# EAGLE design 1010-B1-solarwhat-light (EAGLE 7.5.0)

## Sheet 1 of 3
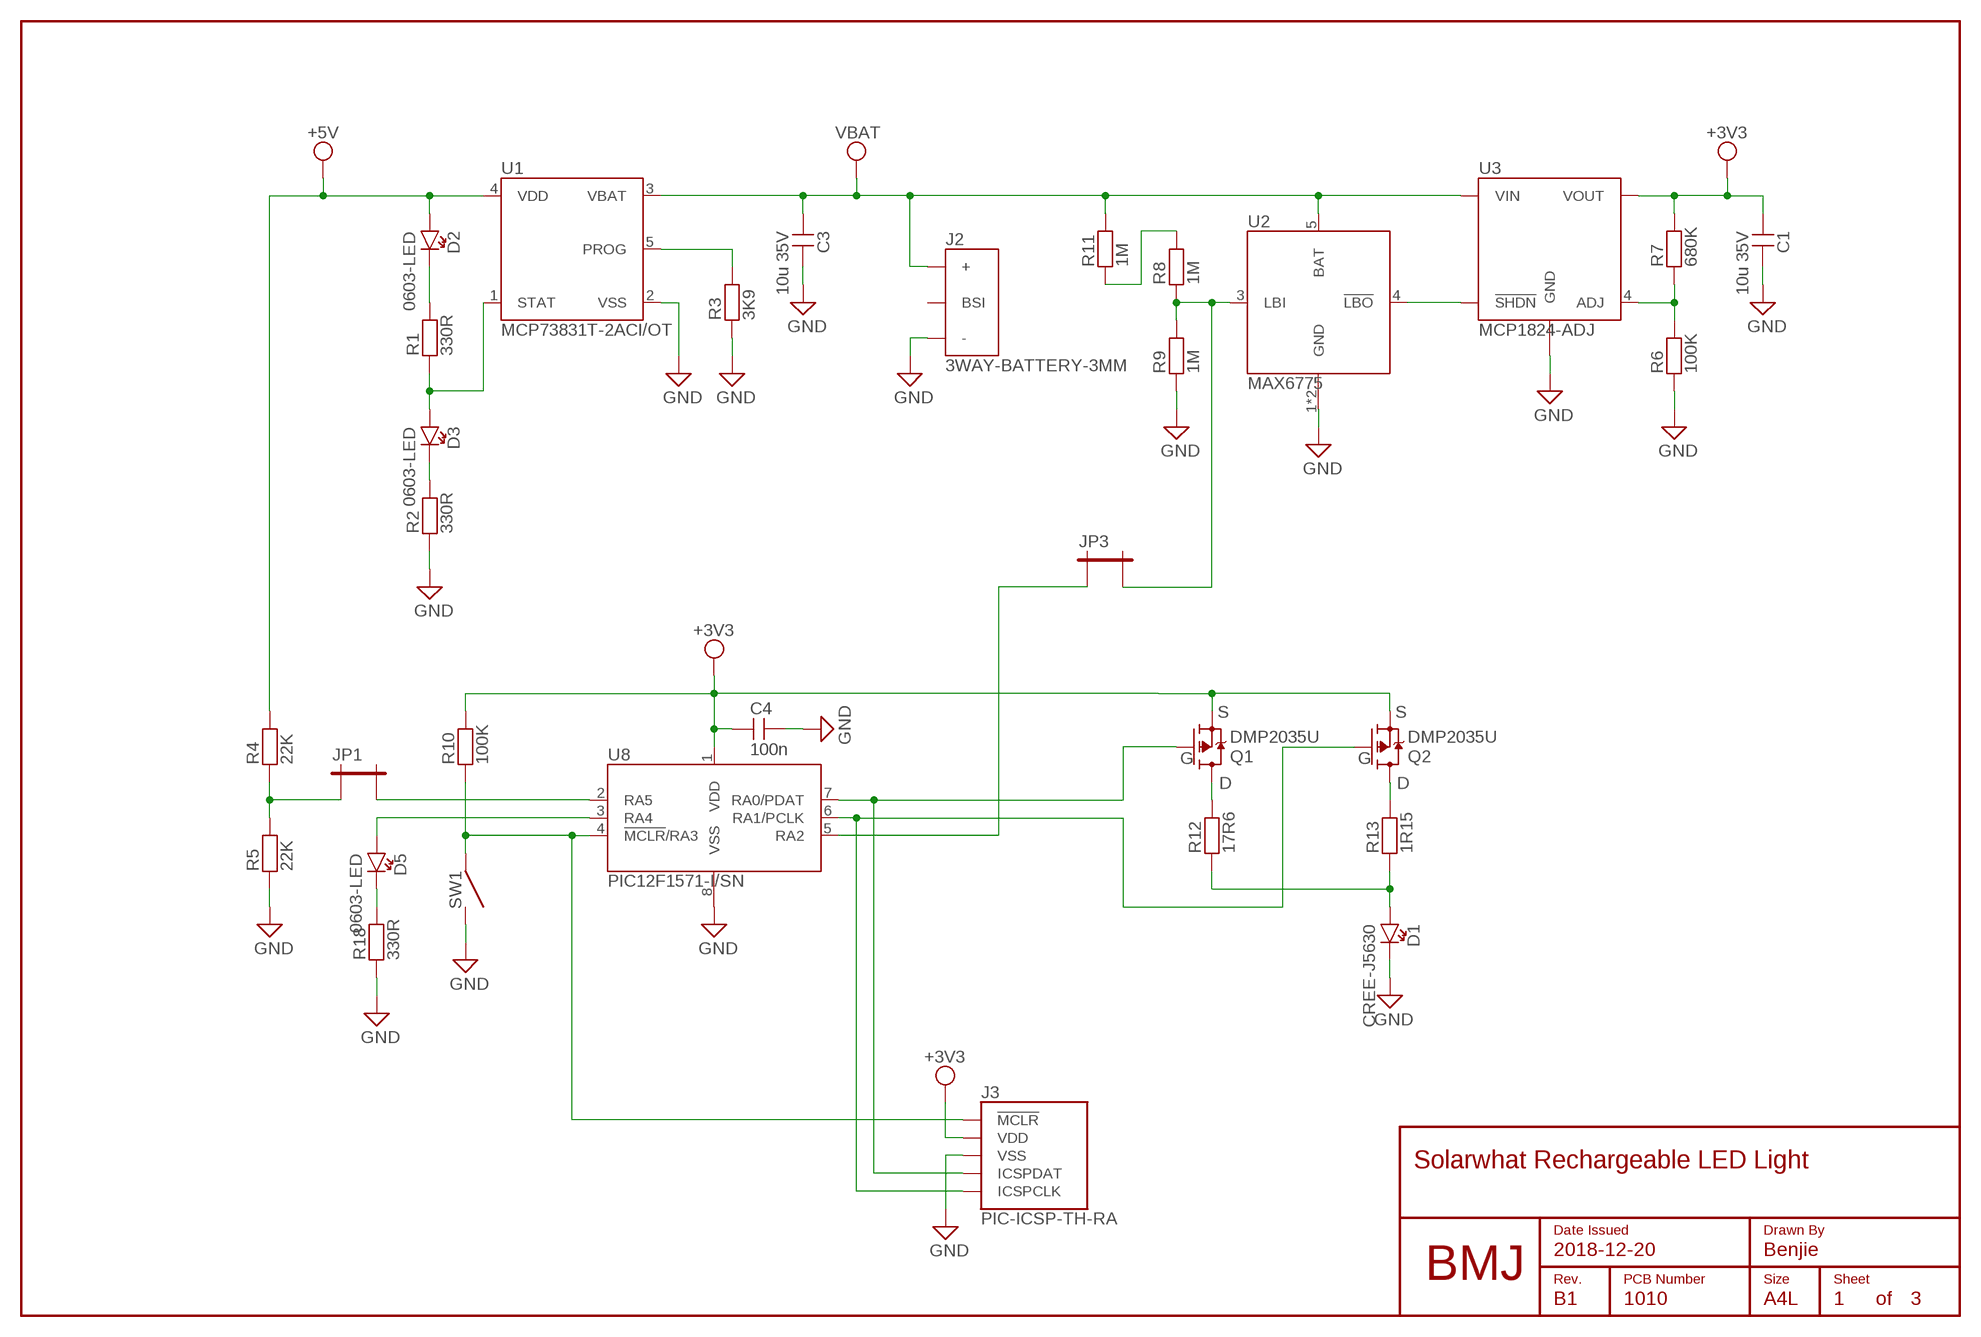
[diagram p0: schematic, sheet 1]

### Parts
C1  10u 35V  1206-10U-35V  [1206]
C3  10u 35V  1206-10U-35V  [1206]
C4  100n  0603-100N  [0603]
D1  CREE-J5630  [CREE-J5630]
D2  0603-LED  [0603-LED]
D3  0603-LED  [0603-LED]
D5  0603-LED  [0603-LED]
FRAME1  A4L-NEW  [PCB-ID]
J2  3WAY-BATTERY-3MM  [3MM-BATTERY-3WAY]
J3  PIC-ICSP-TH-RA  [PIC-ICSP-TH-RA]
JP1  SOLDER-JUMPER-1MM-SQUARE  [SOLDER-JUMPER-1-1]
JP3  SOLDER-JUMPER-1MM-SQUARE  [SOLDER-JUMPER-1-1]
LOGO1  BMJ-LOGO  [BMJ-LOGO]
Q1  DMP2035U  [SOT-23]
Q2  DMP2035U  [SOT-23]
R1  330R  0603-1%-330R  [0603]
R2  330R  0603-1%-330R  [0603]
R3  3K9  0603-1%-3K9  [0603]
R4  22K  0603-1%-22K  [0603]
R5  22K  0603-1%-22K  [0603]
R6  100K  0603-1%-100K  [0603]
R7  680K  0603-1%-680K  [0603]
R8  1M  0603-1%-1M  [0603]
R9  1M  0603-1%-1M  [0603]
R10  100K  0603-1%-100K  [0603]
R11  1M  0603-1%-1M  [0603]
R12  17R6  0805-1%-17R6  [0805]
R13  1R15  0805-1%-1R15  [0805]
R18  330R  0603-1%-330R  [0603]
SW1  ALCOSWITCH-FSM4JSMA  [ALCOSWITCH-FSM4JSMA]
U1  MCP73831T-2ACI/OT  [SOT-23-5]
U2  MAX6775  [SC70]
U3  MCP1824-ADJ  [SOT-23-5]
U8  PIC12F1571-I/SN  [SOIC-8]

### Nets
+3V3: C1.1 C4.1 J3.2(VDD) Q1.2(S) Q2.2(S) R7.2 R10.2 U3.5(VOUT) U8.1(VDD)
+5V: D2.A R4.2 U1.4(VDD) ; also sheet 2
GND: C1.2 C3.2 C4.2 D1.K(C) J2.- J3.3(VSS) R2.1 R3.1 R5.1 R6.1 R9.1 R18.1 SW1.2@1(NO) SW1.2@2(NO) U1.2(VSS) U2.1(GND) U2.2(GND) U3.2(GND) U8.8(VSS) ; also sheet 2
LED_ANODE: D1.A R12.1 R13.1
N$1: D3.C R2.2
N$2: R3.2 U1.5(PROG)
N$3: D3.A R1.1 U1.1(STAT)
N$4: D2.C R1.2
N$5: JP1.1 R4.1 R5.2
N$6: JP1.2 U8.2(RA5)
N$8: R6.2 R7.1 U3.4(ADJ)
N$9: Q2.3(D) R13.2
N$10: JP3.2 R8.1 R9.2 U2.3(LBI)
N$11: J3.5(ICSPCLK) Q2.1(G) U8.6(RA1/PCLK)
N$12: R8.2 R11.1
N$13: Q1.3(D) R12.2
N$14: D5.A U8.3(RA4)
N$17: U2.4(!LBO) U3.3(!SHDN)
N$19: D5.C R18.2
N$24: J3.4(ICSPDAT) Q1.1(G) U8.7(RA0/PDAT)
N$25: J3.1(!MCLR) R10.1 SW1.1@1(COM) SW1.1@2(COM) U8.4(!MCLR!/RA3)
N$26: JP3.1 U8.5(RA2)
VBAT: C3.1 J2.+ R11.2 U1.3(VBAT) U2.5(BAT) U3.1(VIN)
Unconnected: J2.BSI

## Sheet 2 of 3
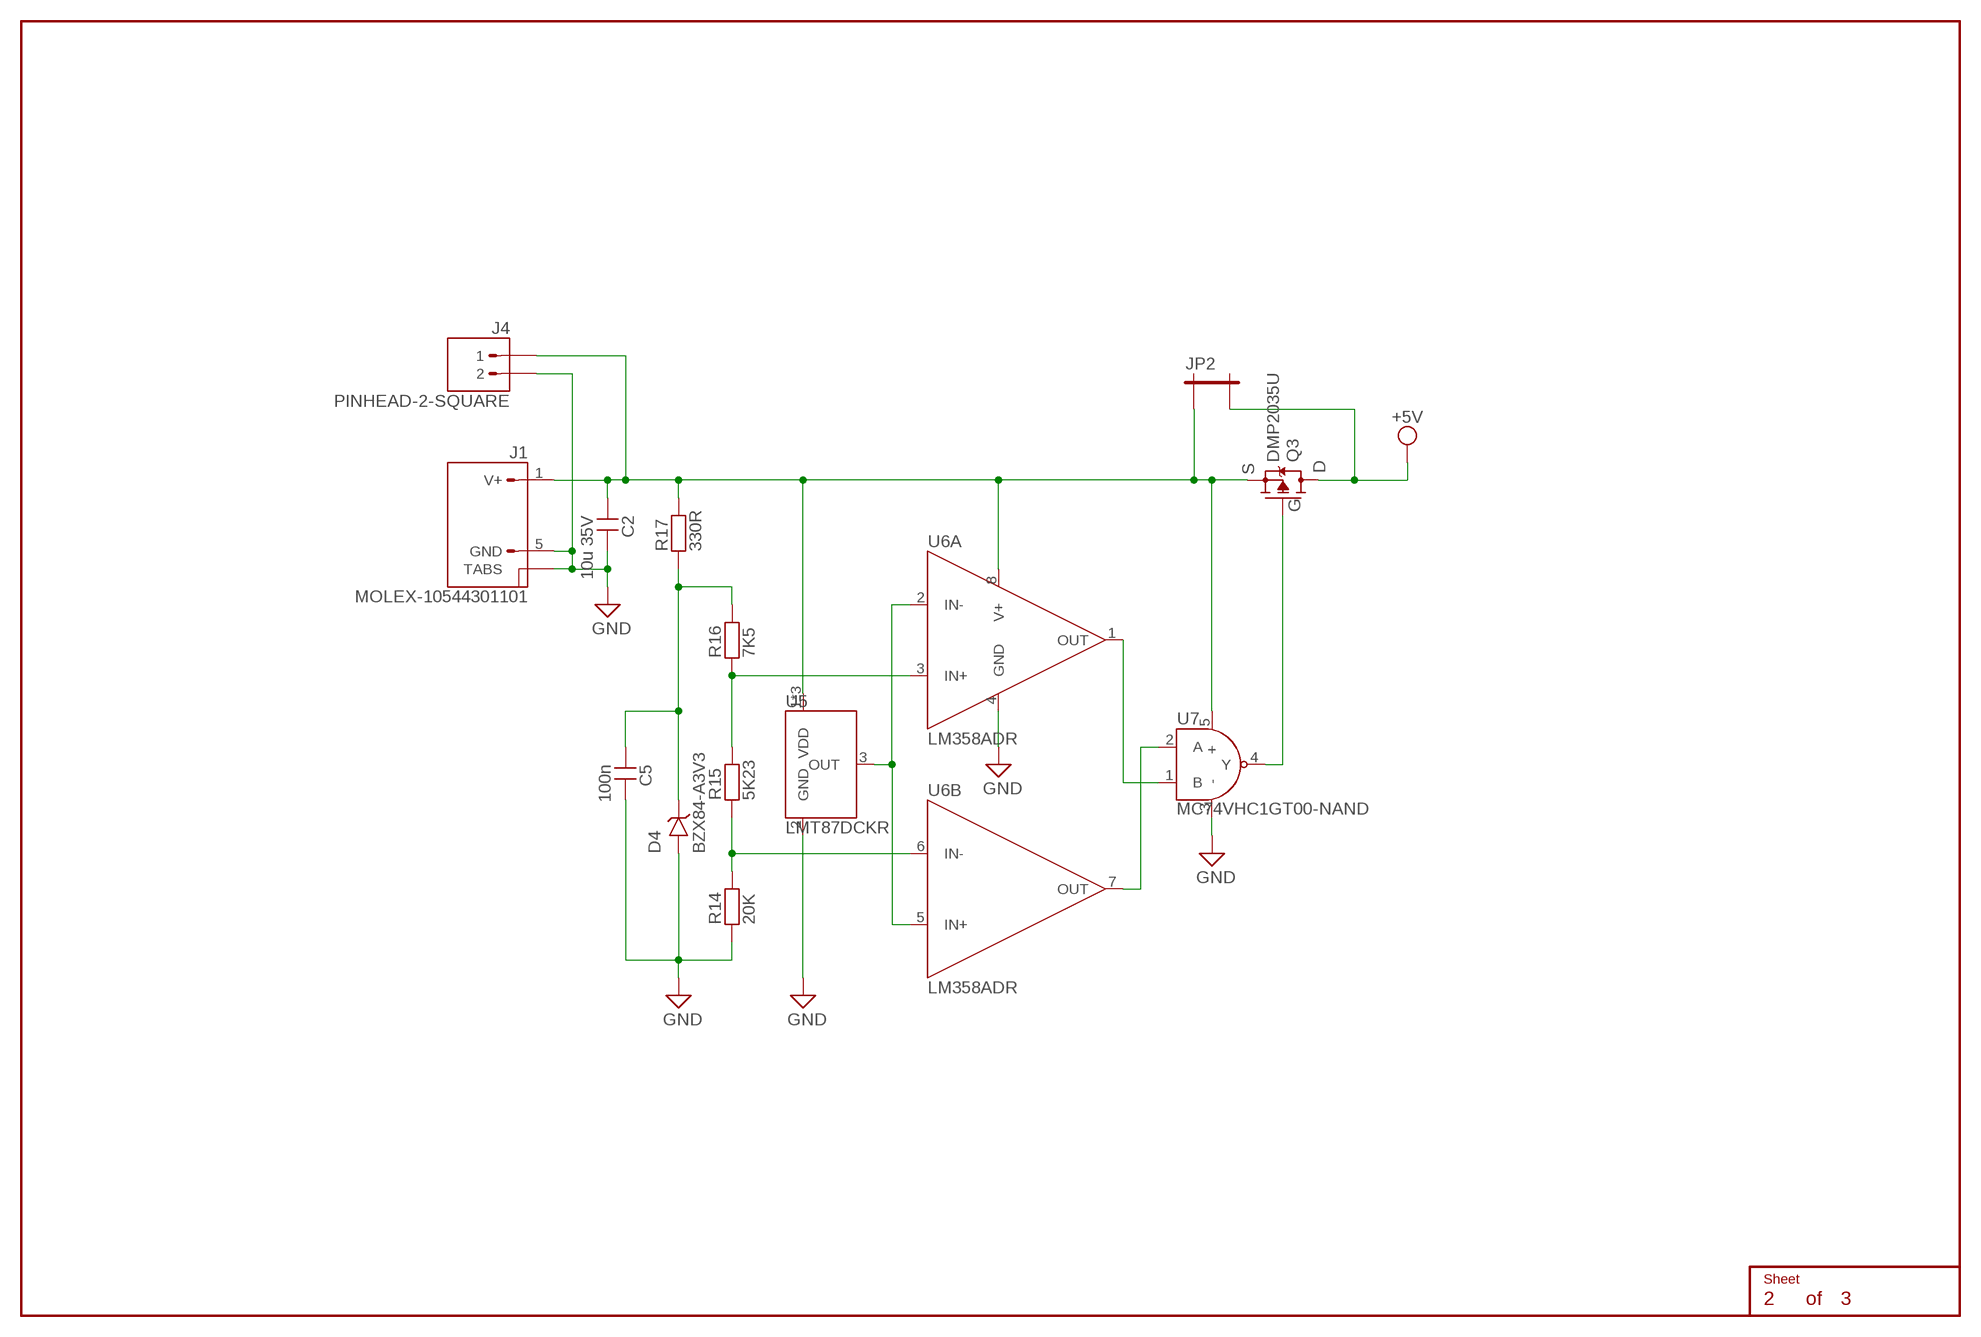
[diagram p1: schematic, sheet 2]

### Parts
C2  10u 35V  1206-10U-35V  [1206]
C5  100n  0603-100N  [0603]
D4  BZX84-A3V3  [SOT-23]
FRAME2  A4L-CONTINUATION  [EMPTY]
J1  MOLEX-10544301101  MOLEX-10544301101-POWERONLY  [MOLEX-105443-1101-POWERONLY]
J4  PINHEAD-2-SQUARE  [PINHEAD-2-SQUARE]
JP2  SOLDER-JUMPER-1MM-SQUARE  [SOLDER-JUMPER-1-1]
Q3  DMP2035U  [SOT-23]
R14  20K  0603-1%-20K  [0603]
R15  5K23  0603-1%-5K23  [0603]
R16  7K5  0603-1%-7K5  [0603]
R17  330R  0603-1%-330R  [0603]
U5  LMT87DCKR  [SC70]
U6  LM358ADR  [SOIC-8]
U7  MC74VHC1GT00-NAND  [SC70]

### Nets
+5V: JP2.2 Q3.3(D) ; also sheet 1
GND: C2.2 C5.2 D4.1(A) J1.5(GND) J1.GND@1(TABS) J1.GND@2(TABS) J1.GND@3(TABS) J1.GND@4(TABS) J1.GND@5(TABS) J1.GND@6(TABS) J4.2 R14.1 U5.2(GND) U6.4(A:GND) U7.3(-) ; also sheet 1
N$7: C2.1 J1.1(V+) J4.1 JP2.1 Q3.2(S) R17.2 U5.1(VDD) U5.4(VDD) U5.5(VDD) U6.8(A:V+) U7.5(+)
N$15: U6.1(A:OUT) U7.1(B)
N$16: U6.7(B:OUT) U7.2(A)
N$18: Q3.1(G) U7.4(Y)
N$20: U5.3(OUT) U6.2(A:IN-) U6.5(B:IN+)
N$21: R14.2 R15.1 U6.6(B:IN-)
N$22: R15.2 R16.1 U6.3(A:IN+)
N$23: C5.1 D4.3(K) R16.2 R17.1

## Sheet 3 of 3
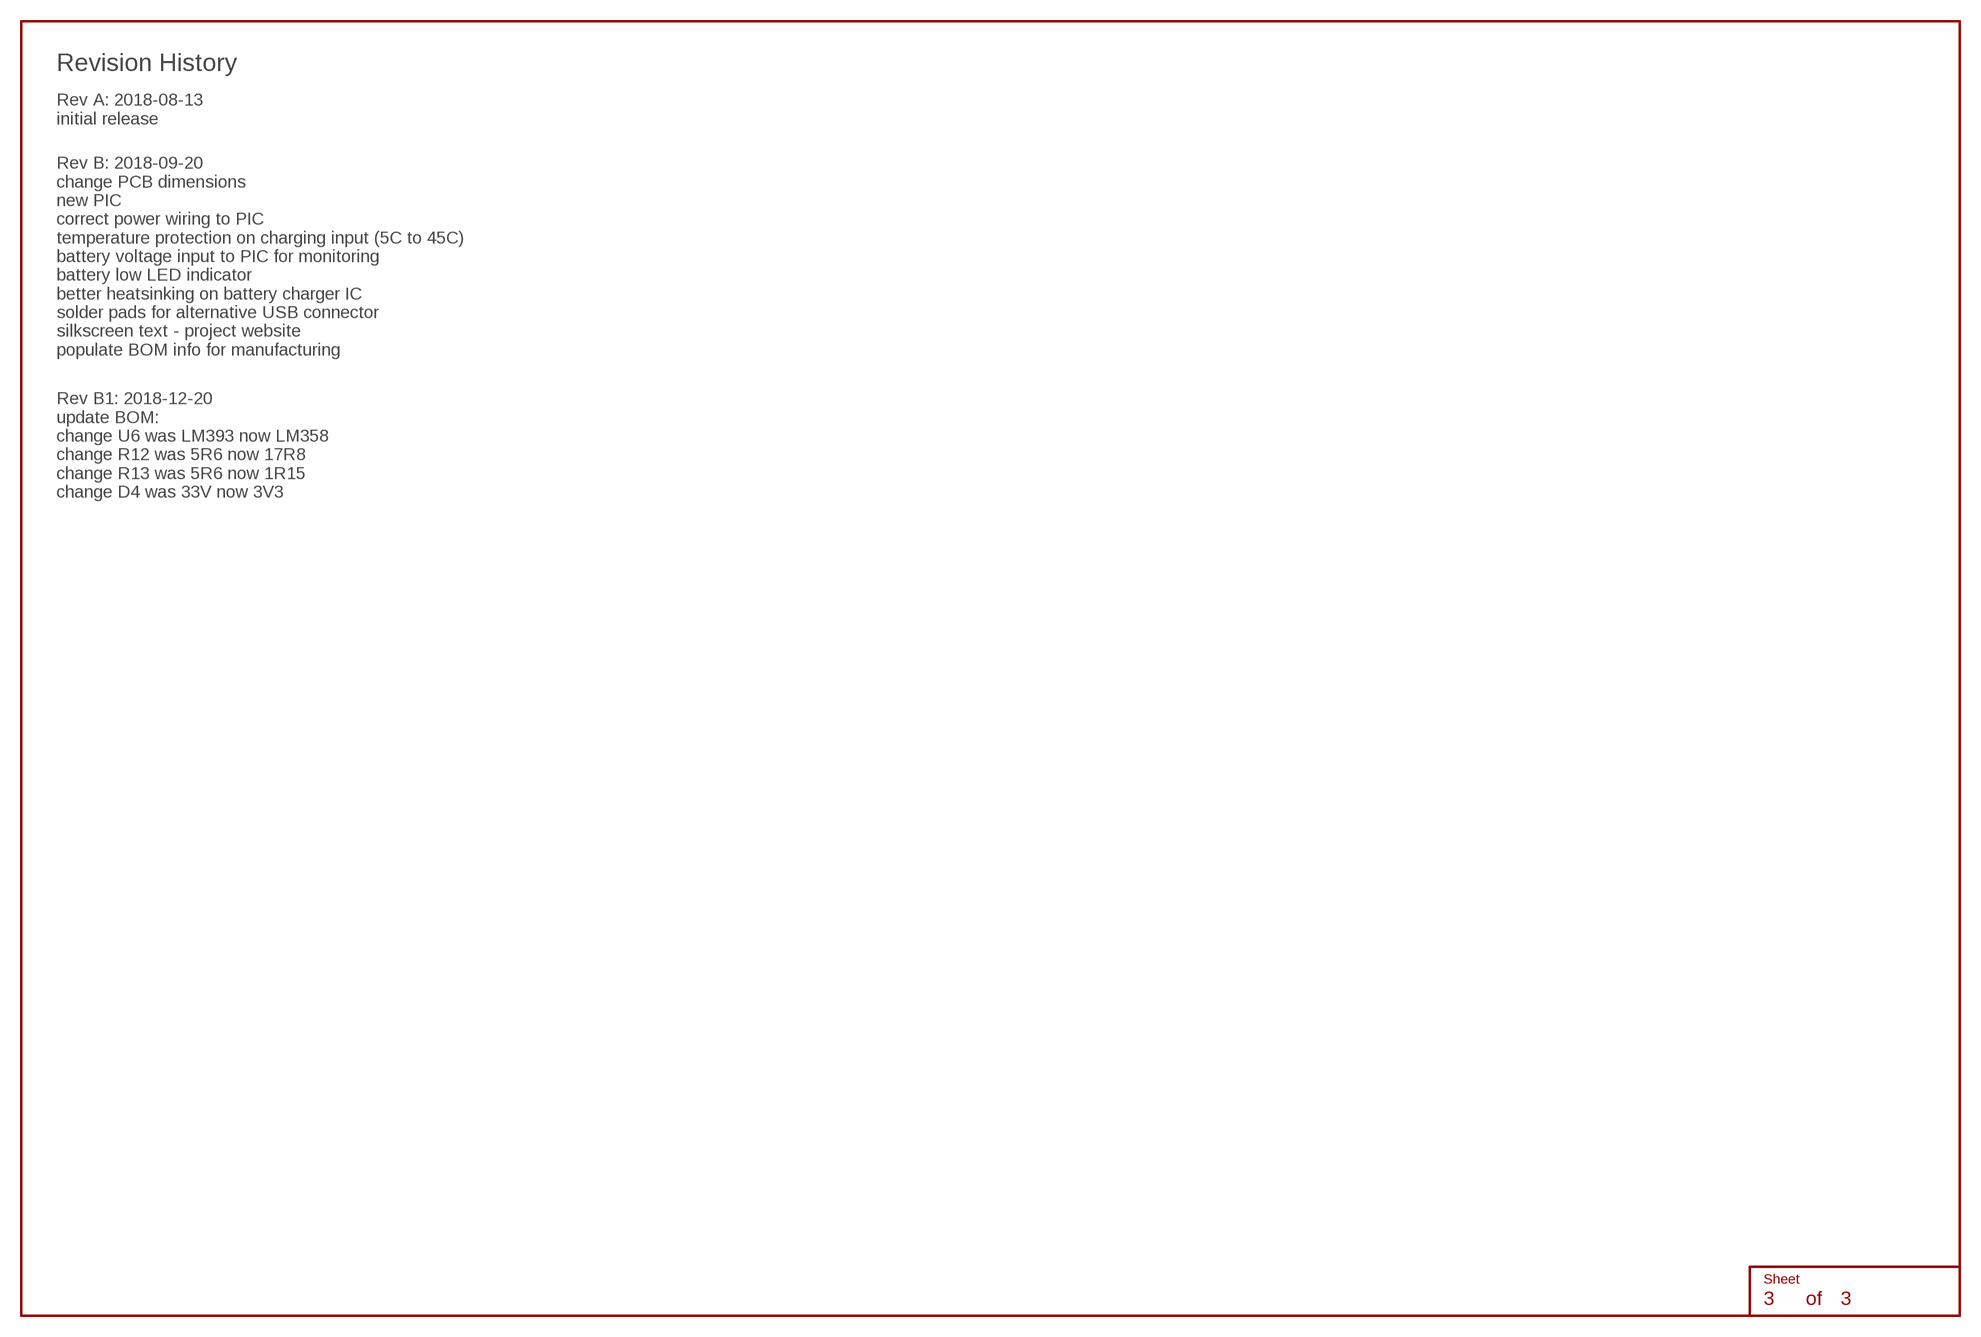
[diagram p2: schematic, sheet 3]

### Parts
FRAME3  A4L-CONTINUATION  [EMPTY]

### Notes on the sheet
- Revision History
- Rev A: 2018-08-13
  initial release
- Rev B: 2018-09-20
  change PCB dimensions
  new PIC
  correct power wiring to PIC
  temperature protection on charging input (5C to 45C)
  battery voltage input to PIC for monitoring
  battery low LED indicator
  better heatsinking on battery charger IC
  solder pads for alternative USB connector
  silkscreen text - project website
  populate BOM info for manufacturing
- Rev B1: 2018-12-20
  update BOM:
  change U6 was LM393 now LM358
  change R12 was 5R6 now 17R8
  change R13 was 5R6 now 1R15
  change D4 was 33V now 3V3

## Library data of the parts
C1-C3 = capacitor-standard:1206; MPN: 1206 10uF 35V 10% X7R; SPN: standard
C4 C5 = capacitor-standard:0603; MPN: 0603 100nF 50V 10% X7R; SPN: standard
D1 = led:CREE-J5630; MPN: Cree JB5630AWT-C0-0000-000A0UC430E; SPN: Farnell 2853292
D2 = led:0603-LED; MPN: 0603 orange; SPN: Farnell 2687484
D3 = led:0603-LED; MPN: 0603 green; SPN: Farnell 2687486
D4 = diode:BZX84; MPN: Nexperia BZX84-A3V3; SPN: Farnell 2463632
D5 = led:0603-LED; MPN: 0603 red; SPN: Farnell 2687488
FRAME1 = frame:A4L-NEW; DATEISSUED: 2018-12-20; DRAWNBY: Benjie; PCBNUMBER: 1010; REVISION: B1; TITLE: Solarwhat Rechargeable LED Light
FRAME2 FRAME3 = frame:A4L-CONTINUATION
J1 = connector-usb:MOLEX-10544301101-POWERONLY; MPN: Molex 10544301-1101; SPN: Farnell 2500017
J2 = connector:3WAY-BATTERY-3MM; MPN: AVX 009155003301006; SPN: Digi-key 478-4687-1-ND
J3 = connector:PIC-ICSP; NOTES: Do not populate
J4 = connector-pinheader:PINHEAD-2; NOTES: Do not populate
JP1 = pcb-features:SOLDER-JUMPER; BOM: no; NOTES: Bridge
JP2 JP3 = pcb-features:SOLDER-JUMPER; BOM: no; NOTES: Do not populate
LOGO1 = logo:BMJ-LOGO
Q1-Q3 = transistor:DMP2035U; MPN: Diodes Inc DMP2035U; SPN: Farnell 2061419
R1 R2 R17 R18 = resistor-standard:0603-1%; MPN: 0603 330R 1% 100mW; SPN: standard
R3 = resistor-special:0603-1%; MPN: 0603 3K9 1% 100mW; SPN: standard
R4 R5 = resistor-standard:0603-1%; MPN: 0603 22K 1% 100mW; SPN: standard
R6 R10 = resistor-standard:0603-1%; MPN: 0603 100K 1% 100mW; SPN: standard
R7 = resistor-standard:0603-1%; MPN: 0603 680K 1% 100mW; SPN: standard
R8 R9 R11 = resistor-standard:0603-1%; MPN: 0603 1M 1% 100mW; SPN: standard
R12 = resistor-special:0805-1%; MPN: 0805 17R8 1% 100mW; SPN: Farnell 2303354
R13 = resistor-special:0805-1%; MPN: 0805 1R15 1% 100mW; SPN: Farnell 2141631
R14 = resistor-special:0603-1%; MPN: 0603 20K 1% 100mW; SPN: standard
R15 = resistor-special:0603-1%; MPN: 0603 5K23 1% 100mW; SPN: standard
R16 = resistor-special:0603-1%; MPN: 0603 7K5 1% 100mW; SPN: standard
SW1 = switch:ALCOSWITCH-FSM4JSMA; MPN: Alcoswitch FSM4JSMA; SPN: Farnell 3801305
U1 = ic-power:MCP73831; MPN: Microchip MCP73831T-2ACI/OT; SPN: Farnell 1332158
U2 = ic-power:MAX6775; MPN: Maxim MAX6775XKB+T; SPN: Farnell 2799268
U3 = ic-power:MCP1824-ADJ; MPN: Microchip MCP1824T-ADJE/OT; SPN: Farnell 1578393
U5 = ic-sensor:LMT87; MPN: TI LMT87DCKR; SPN: Farnell 2782528
U6 = ic-analog:LM358; MPN: TI LM358ADR; SPN: Farnell 7527007
U7 = ic-digital:MC74VHC1GT00-NAND; MPN: On Semi MC74VHC1GT00DF; SPN: Farnell 2724115
U8 = ic-microcontroller:PIC12F1571; MPN: Microchip PIC12F1571-I/SN; SPN: Farnell 2419682

## Board
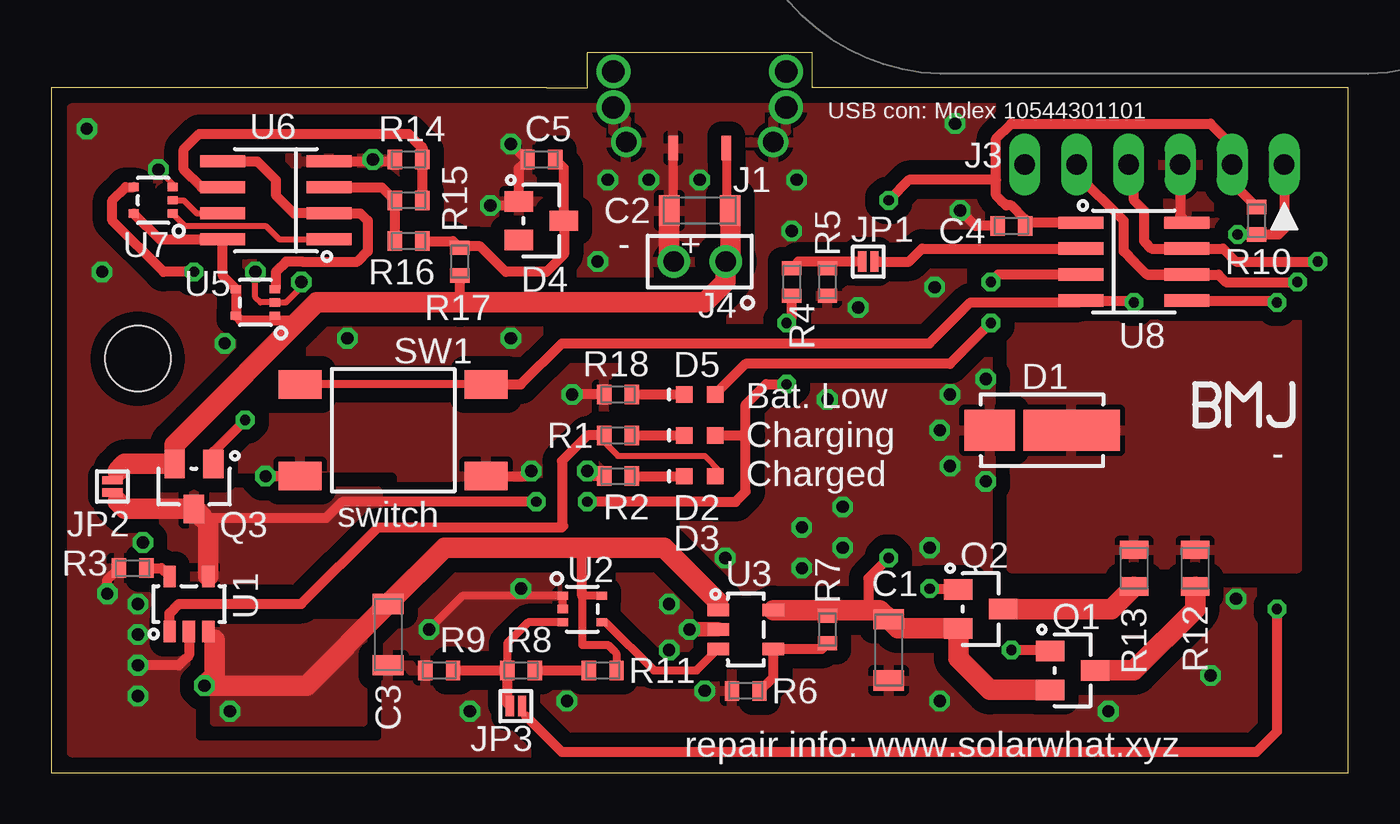
[diagram p3: board, top side]
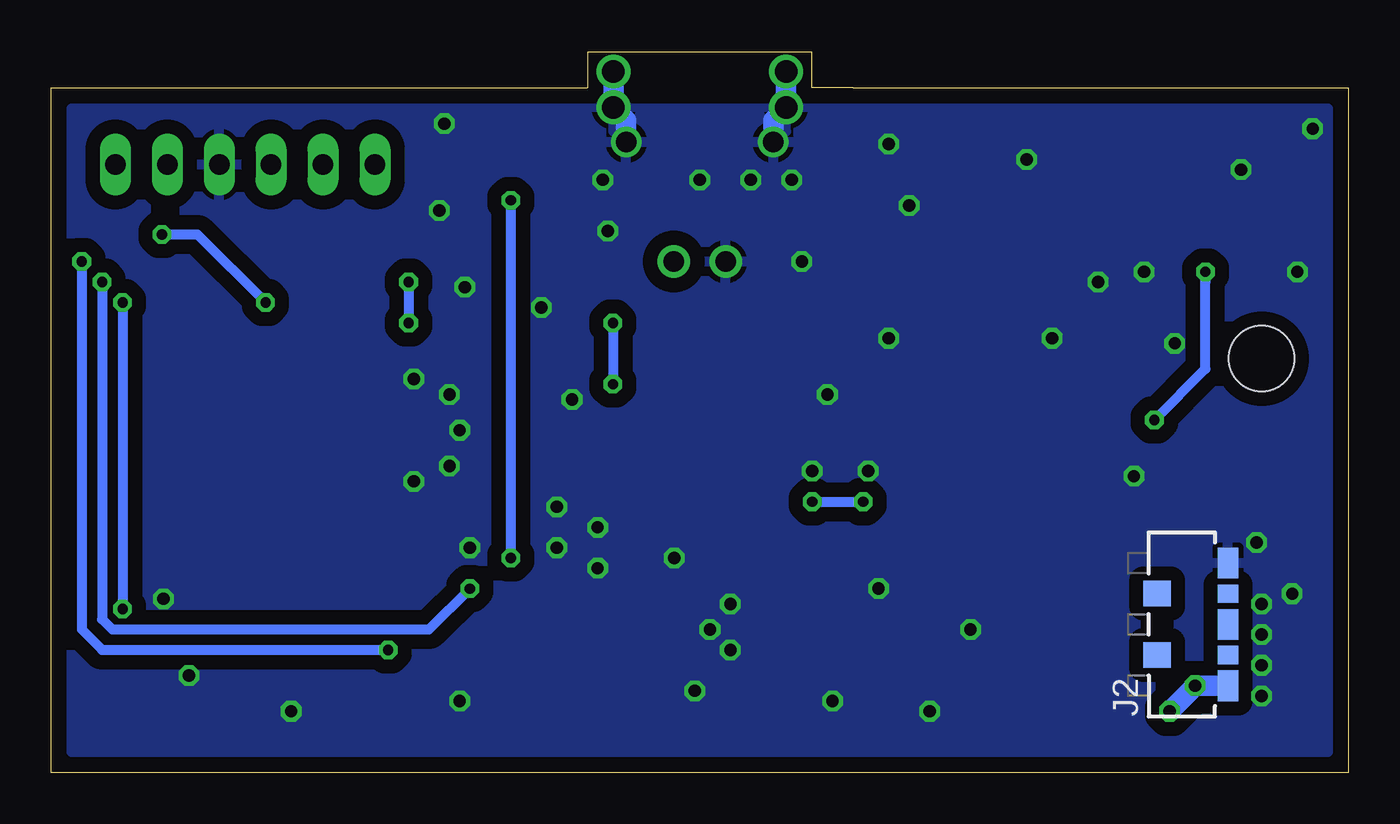
[diagram p4: board, bottom side, seen from below]

Size 63.5 x 35.25 mm. Coordinates in mm from the lower left corner, seen from the top.
Outline: 0,0 63.5,0 63.5,33.5 37.25,33.5 37.25,35.25 26.25,35.25 26.25,33.5 24.25,33.5 0,33.5 0,0
Copper layers (1*16): Top 0.035mm / dielectric 1.5mm / Bottom 0.035mm
Design rules "2-layer-pcb-panel": minimum track width 0.15mm, minimum drill 0.3mm, track to track 0.15mm, track to pad 0.15mm, pad to pad 0.15mm, via to via 0.15mm, smd to smd 0mil, copper to edge 0.5mm, drill to drill 0.8mm, minimum pad ring 10mil, minimum via ring 8mil, stop-mask expansion 4mil, vias tented up to drill 0.6mm, thermal gap 10mil
Holes 3.2 mm at 4.25,20.25
tKeepout: area 10.5,10.5 to 23,23; area 0.2,16.2 to 8.2,24.2; area 0,0 to 2,33.5; area 0,0 to 63.5,2; area 61.5,0 to 63.5,33.5; area 37.2,31.5 to 63.5,33.5; area 0,31.5 to 26.2,33.5

### Footprints (pad centres in the part's own frame; a part is rotated, then mirrored left to right if it is on the bottom)
1206 = smd 1 x 1.5: 1 -1.5,0; 2 1.5,0
0603 = smd 0.7 x 0.95: 1 -0.675,0; 2 0.675,0
CREE-J5630 = smd 4.71 x 2: A 1.445,0 | smd 2.47 x 2: K -2.555,0
0603-LED = smd 0.8 x 0.8: A -0.75,0; C 0.75,0
SOT-23 = smd 1 x 1.4: 1 -0.95,-1.1; 2 0.95,-1.1; 3 0,1.1
MOLEX-105443-1101-POWERONLY = smd 0.45 x 1.2: 1 -1.3,6.7; 5 1.3,6.7 | drill 1: GND@1 -3.6,6.4; GND@6 3.6,6.4 | drill 1.1: GND@2 -4.225,4.7; GND@3 -4.225,2.95; GND@4 4.225,2.95; GND@5 4.225,4.7
3MM-BATTERY-3WAY = smd 1.5 x 1: + -3,-3.88; - 3,-3.88; BSI 0,-3.88 | smd 1.25 x 1.35: PAD1 -1.5,-0.42; PAD4 1.5,-0.42 | smd 0.9 x 1: PAD2 -1.5,-3.88; PAD3 1.5,-3.88
PIC-ICSP-TH-RA = drill 1 long: 1 -6.35,0; 2 -3.81,0; 3 -1.27,0; 4 1.27,0; 5 3.81,0; 6 6.35,0
PINHEAD-2-SQUARE = drill 1 pad 1.6: 1 -1.27,0; 2 1.27,0
SOLDER-JUMPER-1-1 = smd 0.4 x 1: 1 -0.3,0; 2 0.3,0
0805 = smd 0.9 x 1.4: 1 -0.9,0; 2 0.9,0
ALCOSWITCH-FSM4JSMA = smd 2.1 x 1.38: 1@1 -4.55,2.24; 1@2 4.55,2.24; 2@1 -4.55,-2.24; 2@2 4.55,-2.24
SOT-23-5 = smd 0.6 x 1.05: 1 -0.95,-1.35; 2 0,-1.35; 3 0.95,-1.35; 4 0.95,1.35; 5 -0.95,1.35
SC70 = smd 0.5 x 0.4: 1 -0.95,0.65; 2 -0.95,0; 3 -0.95,-0.65; 4 0.95,-0.65; 5 0.95,0.65
SOIC-8 = smd 2.2 x 0.6: 1 -2.6,1.905; 2 -2.6,0.635; 3 -2.6,-0.635; 4 -2.6,-1.905; 5 2.6,-1.905; 6 2.6,-0.635; 7 2.6,0.635; 8 2.6,1.905

### Placement (x,y rotation side)
C1  41,6 270 top
C2  31.75,27.5 180 top
C3  16.5,6.75 270 top
C4  47,26.75 180 top
C5  24,30 180 top
D1  48.5,16.75 0 top
D2  31.75,16.5 180 top
D3  31.75,14.5 180 top
D4  24,27 270 top
D5  31.75,18.5 180 top
FRAME1  55,15 0 top
FRAME2  0,0 0 top
FRAME3  0,0 0 top
J1  31.75,37.25 180 top
J2  9.78,7.25 90 bottom
J3  54,29.75 180 top
J4  31.75,25 180 top
JP1  40,25 0 top
JP2  3,14 270 top
JP3  22.75,3.25 180 top
LOGO1  56,17 0 top
Q1  50,5 270 top
Q2  45.5,8 270 top
Q3  7,14 180 top
R1  27.75,16.5 0 top
R2  27.75,14.5 0 top
R3  4,10 0 top
R4  36.25,24 270 top
R5  38,24 90 top
R6  34,4 0 top
R7  38,7 90 top
R8  23,5 0 top
R9  19,5 0 top
R10  59,27 90 top
R11  27,5 0 top
R12  56,10 270 top
R13  53,10 270 top
R14  17.5,30 0 top
R15  17.5,28 180 top
R16  17.5,26 0 top
R17  20,25 270 top
R18  27.75,18.5 0 top
SW1  16.75,16.75 0 top
U1  6.75,8.25 0 top
U2  26,8 0 top
U3  34,7 270 top
U5  10,23 180 top
U6  11,28 180 top
U7  5,28 180 top
U8  53,25 0 top

### Tracks (layer width: path | path; a pad name or v marks a point on that pad's centre or on a via)
+3V3  (via drill 0.5)
  Top 0.5: U8.1 47.77,26.91 C4.1 47.67,27.07 47,27.75 46.75,27.75 46.5,28 46.25,28.25 | 46.25,28.25 46.25,31 47,31.75 56.75,31.75 57.75,30.75 57.75,29.81 J3.2 57.81,28.86 R10.2 | 46.25,28.25 46.25,29 42,29 v41,28 | v41,10.5 40,9.5 40,7.95 | R7.2 38,7.95
  Top 0.7: R7.2 38,7.95
  Top 1: U3.5 38,7.95 40,7.95 40.55,7.95 C1.1 41.45,7.05 Q2.2 44.4,5.6 45,5 45.95,4.05 Q1.2
  Bottom 0.5: v41,28 v41,10.5
+5V  (via drill 0.5)
  Top 0.3: 3.25,13.25 3.25,13.45 JP2.2
  Top 0.5: R4.2 36.25,22.25 v36,22 | v26.25,13.25 32.5,13.25 33.5,13.25 34,13.75 34,16.5 | v23.75,13.25 14.25,13.25 14,13 13.45,12.45 7.45,12.45 | 34,16.5 34,18 35,19 v36,19 | D2.A 34,16.5
  Top 1: 3.25,13.25 3.6,12.9 Q3.3 7.45,12.45 7.7,12.2 U1.4
  Bottom 0.5: v36,22 v36,19 | v26.25,13.25 v23.75,13.25
  pour Top (isolate 0.7): 5.5,13.75 5.5,9 16,9 16,13.75
GND  (via drill 0.6)
  Top 0.3: v12.25,24 12.25,23.75 11.75,23.25 11.5,23 U5.2 10.25,23 10,23.25 v10,24.5 | U7.3 5.95,28.8 v5.25,29.5
  Top 0.4: U2.2 U2.1 20.15,8.65 v18.5,7
  Top 0.45: J1.5 30.45,27.7 C2.2
  Top 0.5: J3.3 55.27,27.23 U8.8 | U6.4 16.73,29.91 R14.1 | v22.5,30.75 23.25,30 C5.2 22.9,29.57 D4.1 22.7,27.75 v21.5,27.75 | R2.1 26.5,14.5 v26.25,14.75 | R18.1 v25.5,18.5 | SW1.2@2 23.49,14.51 v23.5,14.75 | SW1.2@1 v10.51,14.51 v10.5,14.5 | v2.75,8.75 2.75,9.43 R3.1 | U1.2 6.75,5.75 6.5,5.5 6.25,5.25 v4.25,5.25 | C4.2 45.25,26.75 v44.5,27.5
  Top 0.7: U3.2 v31.25,7
  Top 1: J4.2 30.25,25.23 C2.2
  Bottom 1: J1.GND@4 J1.GND@5 28.15,31.93 J1.GND@6 | J1.GND@3 J1.GND@2 35.35,31.93 J1.GND@1
  other vias: 30.25,8.25 30.25,6 32,4 4.25,6.75 38,18.25 43,11 33,10.5 29.25,29 4.5,11.25 38.75,11 43.5,16.75 44,18.5 44,15 45.75,14.25 45.75,19.25 43.25,23.75 4.25,8.25 31.75,29 4.25,3.75 36.25,26.5 36.5,29 43.5,3.5 56.75,4.75 23,9 15.75,30 39.5,22.75 44.25,31.75 58,8.5 25.25,3.5 20.5,3 1.75,31.5 2.5,24.5 8.5,21 51.75,3 26.75,25 22.5,21.25 14.5,21.25 38.75,13 36.75,12 36.75,10 27.25,29
  pour Top (isolate 0.7, rank 3): 1,32.5 1,1 62.5,1 62.5,32.5
  pour Bottom (isolate 0.7, rank 3): 1,32.5 1,1 62.5,1 62.5,32.5
LED_ANODE
  pour Top (isolate 0.7, rank 2): 47,22 47,10 61,10 61,22
N$1
  Top 0.5: R2.2 D3.C
N$2
  Top 0.5: R3.2 5.4,10 U1.5
N$3
  Top 0.3: R1.1 27.07,16.18 27.75,15.5 32,15.5 32.75,14.75 D3.A
  Top 0.5: U1.1 5.8,7.8 6.25,8.25 12.25,8.25 16,12 25,12 | R1.1 26.25,16.5 25,15.25 25,12 | 25,12 25.07,12.07 25,12
N$4
  Top 0.5: R1.2 D2.C
N$5
  Top 0.3: JP1.1 39.5,25
  Top 0.5: 38,25 R5.2 38,25 | 39.5,25 38.25,25 38,25 | 38,25 36.58,25 R4.1
N$6
  Top 0.3: JP1.2 40.5,25
  Top 0.5: 40.5,25 42,25 42.63,25.64 U8.2
N$7
  Top 0.3: 3.25,14.75 3.25,14.55 JP2.1 | U5.1 11,22.3 11,22.12
  Top 0.45: J1.1 33.05,27.7 C2.1
  Top 0.5: U7.5 5.3,26.09 U6.8 8.4,24.3 U5.4 U5.5 9.28,22.12 11,22.12 12.12,22.12 | R17.2 20,23
  Top 1: C2.1 33.25,25.23 J4.1 33.02,24.02 32,23 20,23 13,23 12.12,22.12 7,17 6.05,16.05 Q3.2 3.6,15.1 3.25,14.75
N$8
  Top 0.5: R6.2 35.35,4.67 U3.4 37.73,6.05 R7.1
N$9
  Top 1: Q2.3 51.9,8 R13.2
N$10
  Top 0.3: 22.32,3.38 JP3.2
  Top 0.4: U2.3 23.35,7.35 22.5,6.5 22.32,6.33 R8.1
  Top 0.5: R9.2 R8.1 22.32,3.38
N$11  (via drill 0.5)
  Top 0.5: U8.6 53.63,24.36 | 53.63,24.36 53,25 52.5,25.5 52.5,27 50.19,29.31 J3.5 | 53.63,24.36 57.13,24.36 57.5,24 v61,24 | v43,9 44.35,9 Q2.1
  Bottom 0.5: v61,24 61,7.5 60.5,7 45,7 v43,9
N$12
  Top 0.5: R8.2 R11.1
N$13
  Top 1: Q1.3 53,5 56,8 R12.2
N$14  (via drill 0.5)
  Top 0.5: U8.3 46.37,24.36 v46,24 | v46,22 44,20 34,20 D5.A
  Bottom 0.5: v46,24 v46,22
N$15
  Top 0.3: U7.1 6.55,26.75 6.75,26.75 10.5,26.75 11.15,26.09 U6.1
N$16
  Top 0.3: U7.2 6.5,28 7.13,27.36 U6.7
N$17
  Top 0.4: U2.4 27.15,7.35 29.5,5 31.6,5 U3.3
N$18  (via drill 0.5)
  Top 0.5: Q3.1 7.95,15.7 v9.5,17.25 | v7,24.5 5.5,24.5 3,27 3,28 3.65,28.65 U7.4
  Bottom 0.5: v9.5,17.25 7,19.75 7,24 v7,24.5
N$19
  Top 0.5: R18.2 D5.C
N$20
  Top 0.3: 11,23.7 U5.3
  Top 0.5: U6.5 10.1,29.91 11,29 11,28.25 11.75,27.5 11.88,27.36 U6.2 15.13,27.36 15.5,27 15.5,25.5 15,25 12.3,25 11.5,25 11,24.5 11,23.7
N$21
  Top 0.5: R15.1 R14.2 18.18,30.57 18,30.75 17.5,31.25 7.25,31.25 6.5,30.5 6.5,29.5 7.37,28.64 U6.6
N$22
  Top 0.5: U6.3 16.19,28.64 R15.2 R16.1
N$23
  Top 0.5: R16.2 19.68,26 R17.1 20.07,25.75 21,25.75 22.25,24.5 24.25,24.5 25.1,25.35 D4.3 25.1,29.57 C5.1
N$24  (via drill 0.5)
  Top 0.5: 53.87,25.64 53.5,26 53.5,27.5 53,28 53,29.48 J3.4 | 53.87,25.64 U8.7 | 53.87,25.64 57.37,25.64 58,25 v62,25 | v47,6 48.85,6 Q1.1
  Bottom 0.5: v62,25 62,7 61,6 v47,6
N$25  (via drill 0.5)
  Top 0.4: SW1.1@2 SW1.1@1
  Top 0.5: J3.1 60.35,27 | 60.35,27 60.35,26.6 | SW1.1@2 22.99,18.99 25,21 43,21 45,23 50.3,23 U8.4 52.91,23.09 v53,23 | 60.35,26.6 60.35,27 | v58.08,26.32 R10.1 60.08,26.32 60.35,26.6
  Bottom 0.5: v53,23 56.33,26.32 v58.08,26.32
N$26  (via drill 0.5)
  Top 0.3: 23.25,2.75 23.05,2.95 JP3.1
  Top 0.5: U8.5 59.91,23.09 v60,23 | v60,8 60,2 59,1 25,1 23.25,2.75
  Bottom 0.5: v60,23 v60,8
VBAT  (via drill 0.6)
  Top 0.4: U2.5 26,8.65 26,6.25 27.25,6.25 27.5,6 27.68,5.83 R11.2
  Top 0.5: U1.3 7.7,6.8 8,6.5 | 32.65,8.35 U3.1 | 26,8.65 26,11
  Top 1: 8,6.5 8,4.75 v7.5,4.25 12.5,4.25 C3.1 19.25,11 26,11 30,11 32.65,8.35
  Bottom 1: J2.+ 7,4.25 v7.5,4.25 v8.75,3
  pour Top (isolate 0.7): 8,7.25 8,2.5 15.25,2.5 15.25,7.25

### Text on the board
tPlace: USB con: Molex 10544301101 | - + | Bat. Low / Charging / Charged | switch | repair info: www.solarwhat.xyz